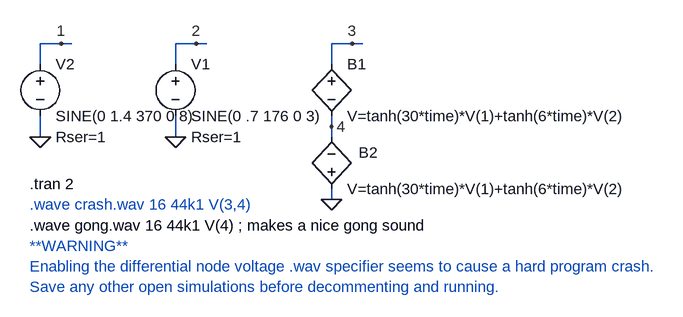
[diagram p0: schematic wavetest.asc]
wavetest.asc, the LTspice schematic file:
Version 4
SHEET 1 960 680
WIRE -64 192 -96 192
WIRE -48 192 -64 192
WIRE 144 192 112 192
WIRE 160 192 144 192
WIRE 384 192 352 192
WIRE 400 192 384 192
WIRE -96 224 -96 192
WIRE 112 224 112 192
WIRE 352 224 352 192
WIRE 352 320 352 304
WIRE -96 336 -96 304
WIRE 112 336 112 304
WIRE 352 336 352 320
WIRE 352 432 352 416
FLAG 112 336 0
FLAG 144 192 2
FLAG 384 192 3
FLAG 352 432 0
FLAG -96 336 0
FLAG -64 192 1
FLAG 352 320 4
SYMBOL voltage 112 208 R0
WINDOW 123 0 0 Left 0
WINDOW 39 24 128 Left 0
SYMATTR SpiceLine Rser=1
SYMATTR InstName V1
SYMATTR Value SINE(0 .7 176 0 3)
SYMBOL bv 352 208 R0
SYMATTR InstName B1
SYMATTR Value V=tanh(30*time)*V(1)+tanh(6*time)*V(2)
SYMBOL voltage -96 208 R0
WINDOW 123 0 0 Left 0
WINDOW 39 24 128 Left 0
SYMATTR SpiceLine Rser=1
SYMATTR InstName V2
SYMATTR Value SINE(0 1.4 370 0 8)
SYMBOL bv 352 432 M180
WINDOW 0 42 72 Left 0
WINDOW 3 24 16 Left 0
SYMATTR InstName B2
SYMATTR Value V=tanh(30*time)*V(1)+tanh(6*time)*V(2)
TEXT -112 408 Left 0 !.tran 2
TEXT -112 472 Left 0 !.wave gong.wav 16 44k1 V(4) ; makes a nice gong sound
TEXT -112 440 Left 0 ;.wave crash.wav 16 44k1 V(3,4)
TEXT -112 504 Left 0 ;**WARNING**\nEnabling the differential node voltage .wav specifier seems to cause a hard program crash.\nSave any other open simulations before decommenting and running.

The netlist it stands for:
* wavetest.asc
V1 2 0 SINE(0 .7 176 0 3) Rser=1
B1 3 4 V=tanh(30*time)*V(1)+tanh(6*time)*V(2)
V2 1 0 SINE(0 1.4 370 0 8) Rser=1
B2 0 4 V=tanh(30*time)*V(1)+tanh(6*time)*V(2)
.tran 2
.wave gong.wav 16 44k1 V(4) ; makes a nice gong sound
* .wave crash.wav 16 44k1 V(3,4)
* **WARNING**
* Enabling the differential node voltage .wav specifier seems to cause a hard program crash.
* Save any other open simulations before decommenting and running.
.backanno
.end